# EasyEDA schematic s1_sch.json
TITLE: Relay Board ESP8266; REV: 1.0; Date: 2018-06-06; Sheet: 1/1; Drawn By: CobaltDragon
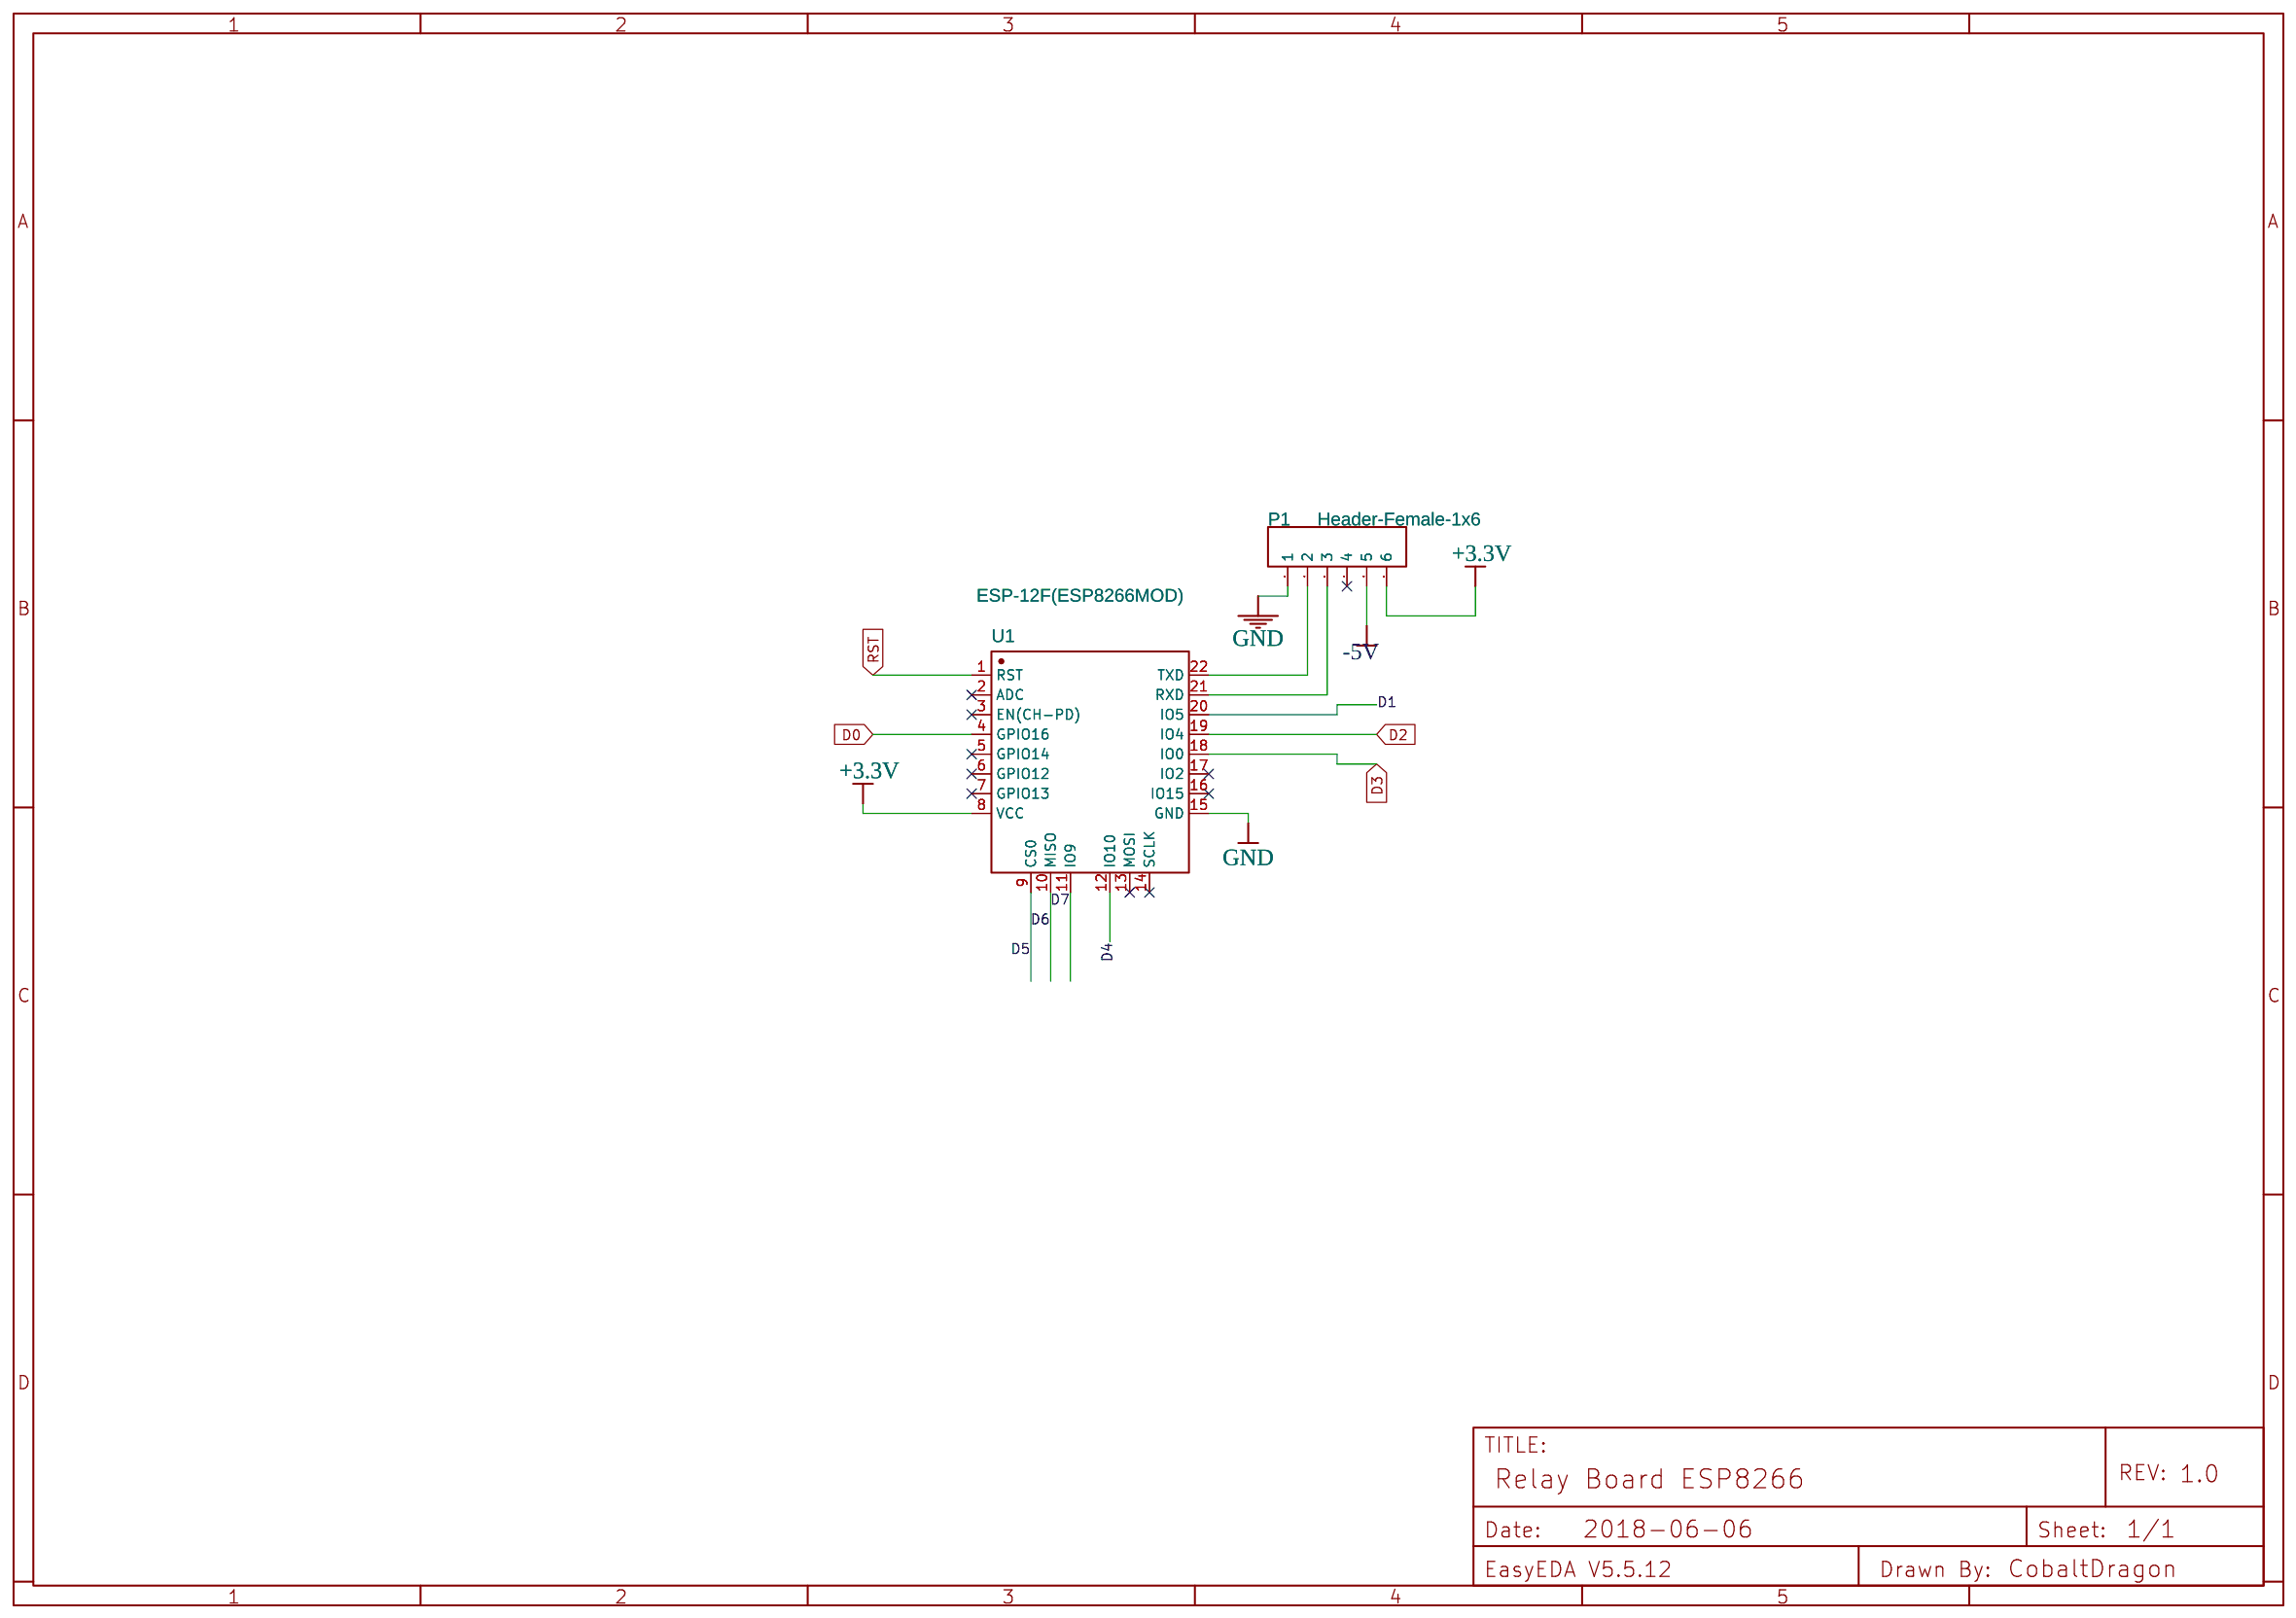
[diagram p0: schematic sheet]

## Parts
P1  Header-Female-1x6  [HDR-6X1/2.54]
U1  ESP-12F(ESP8266MOD)  [ESP-12F(ESP8266MOD)]

## Library data of the parts
P1 = -: Supplier: LCSC; Manufacturer: BOOMELE; Manufacturer Part: Female header 1*6p; Supplier Part: C40877
U1 = -: Supplier: LCSC; Manufacturer: Ai-Thinker; Supplier Part: C82891

## Nets
+3.3V: P1.6 U1.8(VCC)
-5V: P1.5
GND: P1.1 U1.15(GND)
D0: U1.4(GPIO16)
D1: U1.20(IO5)
D2: U1.19(IO4)
D3: U1.18(IO0)
D4: U1.12(IO10)
D5: U1.9(CS0)
D6: U1.10(MISO)
D7: U1.11(IO9)
RST: U1.1(RST)
Net-(P1-2): P1.2 U1.22(TXD)
Net-(P1-3): P1.3 U1.21(RXD)

Not connected (* = marked no-connect by the designer): P1 4*; U1 2(ADC)* 3(EN(CH-PD))* 5(GPIO14)* 6(GPIO12)* 7(GPIO13)* 13(MOSI)* 14(SCLK)* 16(IO15)* 17(IO2)*
